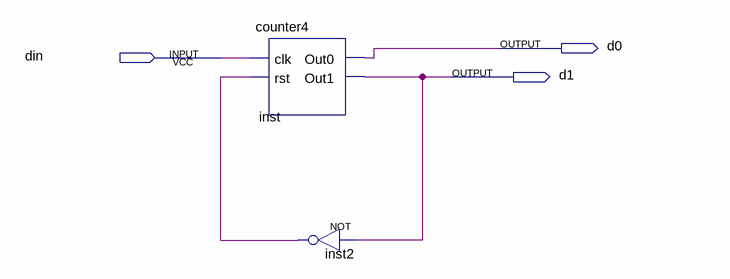
[diagram p0: schematic sheet]
// Quartus schematic counter4_test.bdf as structural Verilog: 2 symbols, 3 pins
module counter4_test (
  input  din,
  output d0,
  output d1
);

  wire inst2_out;

  counter4 inst (.clk(din), .rst(inst2_out), .Out0(d0), .Out1(d1));
  not inst2 (inst2_out, d1);
endmodule
